# Altium schematic sheet Pasa_bajas.SchDoc
size A; SheetNumber: 1; SheetTotal: 4
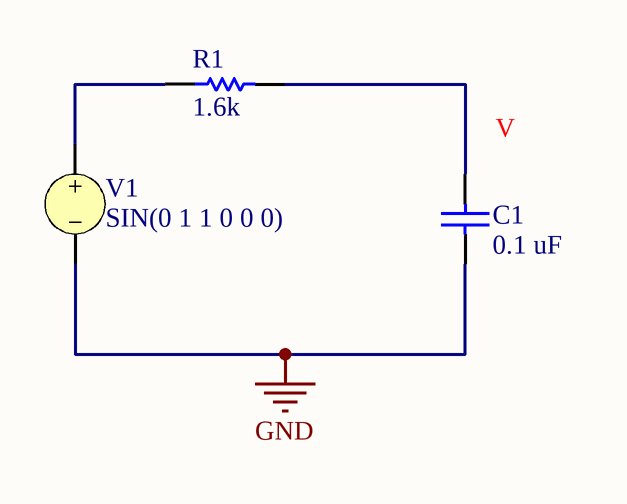
[diagram p0: Pasa_bajas.SchDoc]

## Parts
C1  value 0.1 uF  (hidden comment: Capacitor)
R1  value 1.6k  (hidden comment: Resistor)
V1  SIN(0 1 1 0 0 0)

## Nets
GND: C1.1 V1.2
NetC1_2: C1.2 R1.2
NetR1_1: R1.1 V1.1

## Library data of the parts
C1 = Capacitor: SimulationGenericComponent: True
R1 = Resistor: TC1: 0; SimulationGenericComponent: True; TC2: 0
V1 = VSRC: Voltage Source; Note: PCB Footprint - Not required; AC Magnitude: 1; AC Phase: 0; Published: 8-Jun-2000; LatestRevisionDate: 17-Jul-2002; LatestRevisionNote: Re-released for DXP Platform.; PackageReference: Not Applicable; Publisher: Altium Limited; DC Magnitude: 1; Offset: 0; Amplitude: 1; Frequency: 1; Delay: 0; Damping Factor: 0; Phase: 0